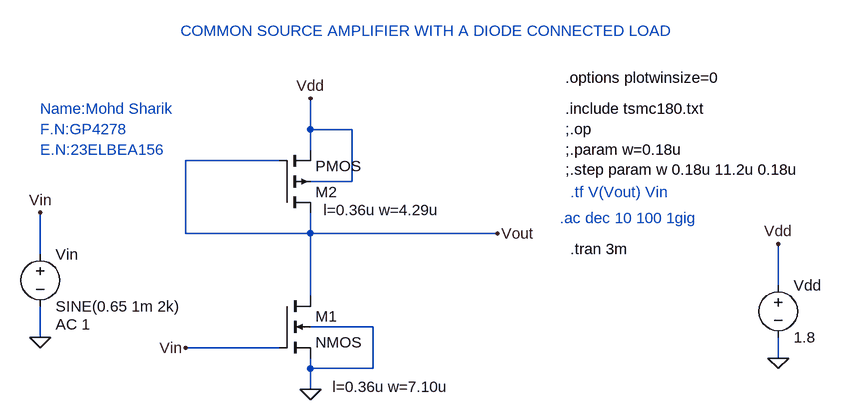
[diagram p0: schematic COMMON SOURCE AMPLIFIER WITH A DIODE CONNECTED LOAD.asc]
COMMON SOURCE AMPLIFIER WITH A DIODE CONNECTED LOAD.asc, the LTspice schematic file:
Version 4
SHEET 1 880 680
WIRE 48 48 48 0
WIRE 112 48 48 48
WIRE 48 80 48 48
WIRE 0 96 -144 96
WIRE 112 128 112 48
WIRE 112 128 48 128
WIRE -144 208 -144 96
WIRE 48 208 48 176
WIRE 48 208 -144 208
WIRE 336 208 48 208
WIRE -368 240 -368 176
WIRE 768 288 768 224
WIRE 48 304 48 208
WIRE 144 352 48 352
WIRE -368 368 -368 320
WIRE 0 384 -144 384
WIRE 768 400 768 368
WIRE 48 416 48 400
WIRE 144 416 144 352
WIRE 144 416 48 416
WIRE 48 448 48 416
FLAG 48 448 0
FLAG 768 400 0
FLAG -368 368 0
FLAG -144 384 Vin
FLAG -368 176 Vin
FLAG 48 0 Vdd
FLAG 768 224 Vdd
FLAG 336 208 Vout
SYMBOL pmos4 0 176 M180
WINDOW 123 68 4 Left 2
SYMATTR InstName M2
SYMATTR Value2 l=0.36u w=4.29u
SYMBOL nmos4 0 304 R0
WINDOW 123 82 140 Left 2
SYMATTR InstName M1
SYMATTR Value2 l=0.36u w=7.10u
SYMBOL voltage -368 224 R0
WINDOW 123 24 124 Left 2
WINDOW 39 0 0 Left 0
SYMATTR InstName Vin
SYMATTR Value SINE(0.65 1m 2k)
SYMATTR Value2 AC 1
SYMBOL voltage 768 272 R0
WINDOW 123 0 0 Left 0
WINDOW 39 0 0 Left 0
SYMATTR InstName Vdd
SYMATTR Value 1.8
TEXT 440 16 Left 2 !.include tsmc180.txt\n;.op\n;.param w=0.18u\n;.step param w 0.18u 11.2u 0.18u
TEXT 448 144 Left 2 ;.tf V(Vout) Vin
TEXT 432 184 Left 2 ;.ac dec 10 100 1gig
TEXT 448 232 Left 2 !.tran 3m
TEXT 440 -32 Left 2 !.options plotwinsize=0
TEXT -152 -104 Left 2 ;COMMON SOURCE AMPLIFIER WITH A DIODE CONNECTED LOAD
TEXT -368 16 Left 2 ;Name:Mohd Sharik\nF.N:GP4278\nE.N:23ELBEA156

The netlist it stands for:
* COMMON SOURCE AMPLIFIER WITH A DIODE CONNECTED LOAD.asc
M2 Vout Vout Vdd Vdd PMOS l=0.36u w=4.29u
M1 Vout Vin 0 0 NMOS l=0.36u w=7.10u
Vin Vin 0 SINE(0.65 1m 2k) AC 1
Vdd Vdd 0 1.8
.model NMOS NMOS
.model PMOS PMOS
.lib standard.mos
.include tsmc180.txt
;.op
;.param w=0.18u
;.step param w 0.18u 11.2u 0.18u
* .tf V(Vout) Vin
* .ac dec 10 100 1gig
.tran 3m
.options plotwinsize=0
* COMMON SOURCE AMPLIFIER WITH A DIODE CONNECTED LOAD
* Name:Mohd Sharik
* F.N:GP4278
* E.N:23ELBEA156
.backanno
.end